# EasyEDA Pro project ProPrj_嵌赛国赛_2025-08-15.epro, schematic Schematic3

## Sheets
1 P1: Board Name: 药箱传感器板; Create Date: 2025-06-10; Page Name: P1; Project Name: 嵌入式大赛; Schematic Name: Schematic3; Update Date: 2025-06-26; Company: 嘉立创EDA; Page Size: A4; Version: V1.0
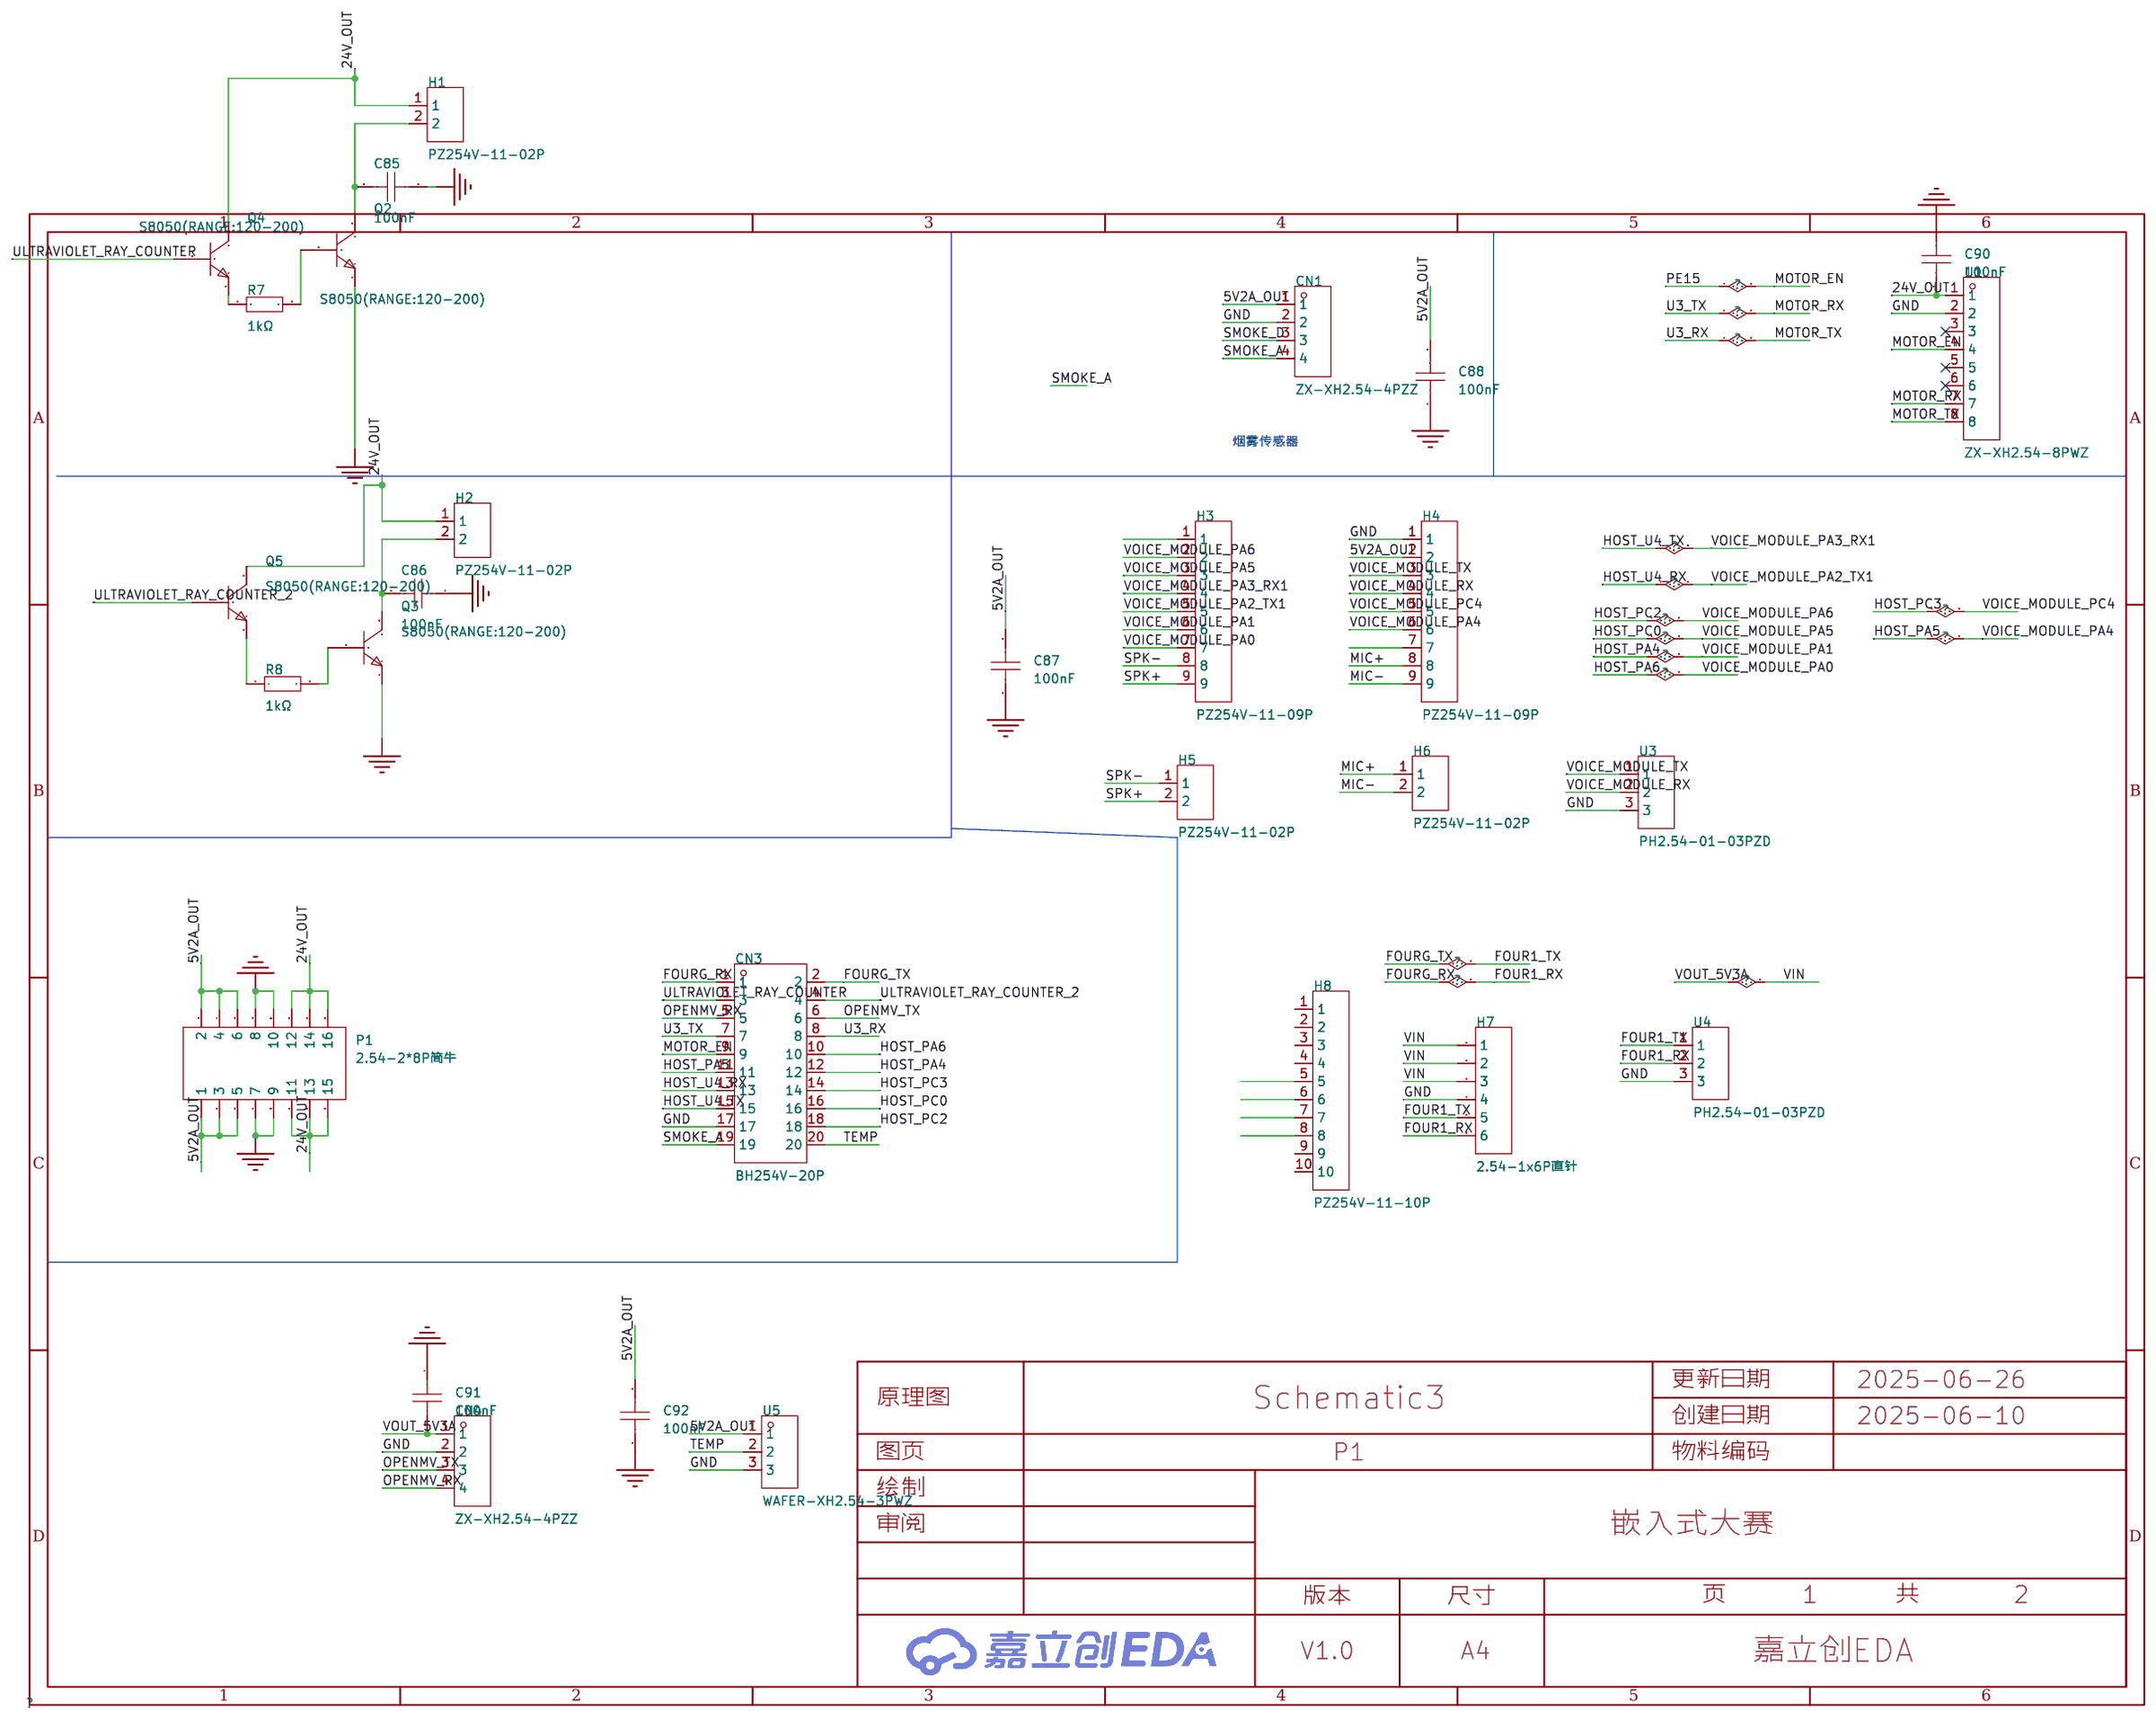
[diagram p2: P1]
2 P2: Create Date: 2025-06-18; Page Name: P2; Update Date: 2025-06-18
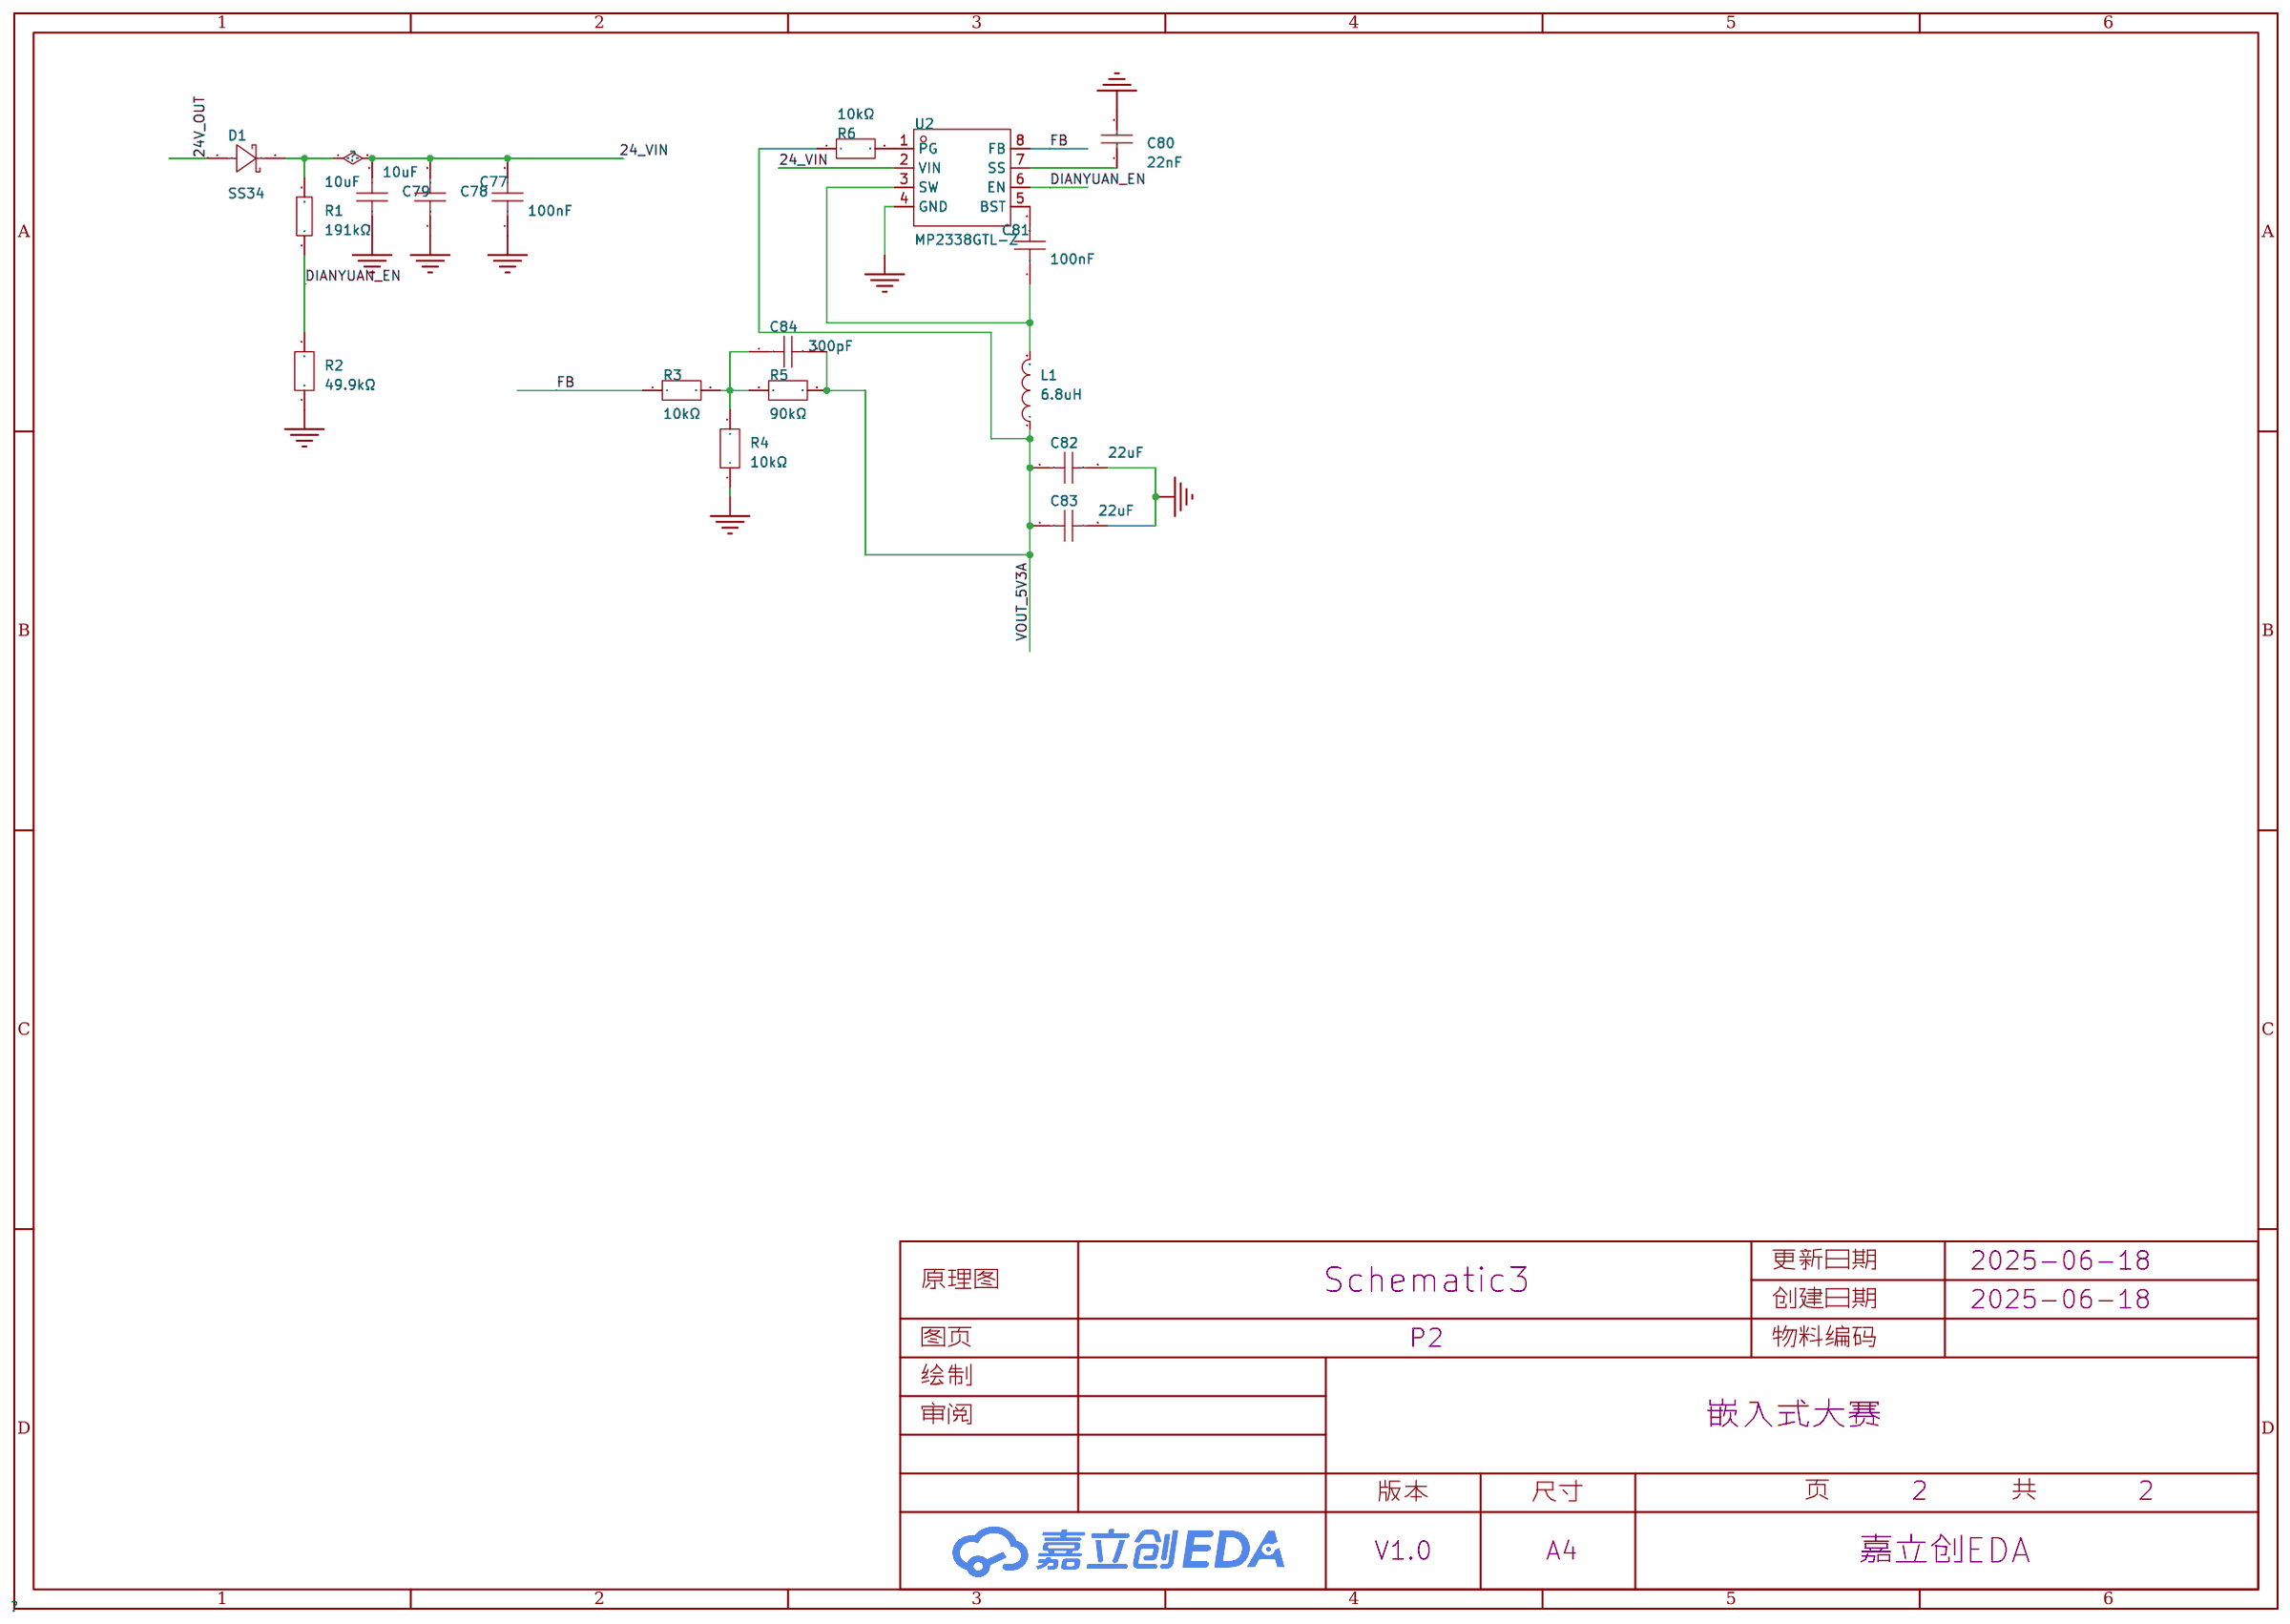
[diagram p3: P2]

## Parts
sheet P1
C85  100nF  [C0603]
C86  100nF  [C0603]
C87  100nF  [C0603]
C88  100nF  [C0603]
C90  100nF  [C0603]
C91  100nF  [C0603]
C92  100nF  [C0603]
CN1  ZX-XH2.54-4PZZ  [CONN-TH_4P-P2.50_4PIN]
CN3  BH254V-20P  [CONN-TH_20P-P2.54_0702462001]
CN4  ZX-XH2.54-4PZZ  [CONN-TH_4P-P2.50_4PIN]
H1  PZ254V-11-02P  [HDR-TH_2P-P2.54-V-M]
H2  PZ254V-11-02P  [HDR-TH_2P-P2.54-V-M]
H3  PZ254V-11-09P  [HDR-TH_9P-P2.54-V-M]
H4  PZ254V-11-09P  [HDR-TH_9P-P2.54-V-M]
H5  PZ254V-11-02P  [HDR-TH_2P-P2.54-V-M]
H6  PZ254V-11-02P  [HDR-TH_2P-P2.54-V-M]
H7  2.54-1x6P直针  [HDR-TH_6P-P2.54-V-M-1]
H8  PZ254V-11-10P  [HDR-TH_10P-P2.54-V-M]
P1  2.54-2*8P简牛  [IDC-TH_16P-P2.54_C3406]
Q2  S8050(RANGE:120-200)  [TO-92-3_L4.9-W3.7-P1.27-L]
Q3  S8050(RANGE:120-200)  [TO-92-3_L4.9-W3.7-P1.27-L]
Q4  S8050(RANGE:120-200)  [TO-92-3_L4.9-W3.7-P1.27-L]
Q5  S8050(RANGE:120-200)  [TO-92-3_L4.9-W3.7-P1.27-L]
R7  1kΩ  [R0603]
R8  1kΩ  [R0603]
U1  ZX-XH2.54-8PWZ  [CONN-TH_8P-P2.50_ZX-XH2.54-8PWZ]
U3  PH2.54-01-03PZD  [HDR-TH_3P-P2.54-V-M]
U4  PH2.54-01-03PZD  [HDR-TH_3P-P2.54-V-M]
U5  WAFER-XH2.54-3PWZ  [CONN-TH_3P-P2.50_WAFER-XH2.54-3PWZ]
sheet P2
C77  100nF  [C0603]
C78  10uF  [C1206]
C79  10uF  [C1206]
C80  22nF  [C0603]
C81  100nF  [C0603]
C82  22uF  [C0603]
C83  22uF  [C0603]
C84  300pF  [C0603]
D1  SS34  [SMA_L4.3-W2.6-LS5.0-FD]
L1  6.8uH  [IND-SMD_L11.0-W10.0]
R1  191kΩ  [R0603]
R2  49.9kΩ  [R0603]
R3  10kΩ  [R0603]
R4  10kΩ  [R0603]
R5  90kΩ  [R0603]
R6  10kΩ  [R0603]
U2  MP2338GTL-Z  [SOT-583-8_L2.1-W1.2-P0.50-LS1.6-BR]

## Library data of the parts
C77 C81 C85-C88 C90-C92 = CC0603KRX7R9BB104: 容值:100nF;精度:±10%;额定电压:50V;材质(温度系数):X7R;; LCSC Part Name: 100nF ±10% 50V; Supplier Part: C14663; Manufacturer: YAGEO(国巨); Supplier Footprint: 0603; JLCPCB Part Class: Basic Part; Datasheet: https://atta.szlcsc.com/upload/public/pdf/source/20180910/C282072_33301C7F631E79921B82A8DAC6BCC5B3.pdf; Supplier: LCSC; Tolerance: ±10%; Voltage Rated: 50V; Temperature Coefficient: X7R
CN1 CN4 = ZX-XH2.54-4PZZ: 插针结构:1x4P;间距:2.5mm;安装方式:直插;参考系列:XH;总PIN数:4P;排数:1;每排PIN数:4;行距:-;额定电流:3A;触头材质:黄铜;触头镀层:锡;工作温度范围:-25℃~+85℃;; LCSC Part Name: 1x4P 间距:2.5mm 直插 系列:XH; Supplier Part: C7429634; Manufacturer: Megastar(兆星); Supplier Footprint: 插件,P=2.5mm; JLCPCB Part Class: 扩展库; Datasheet: https://atta.szlcsc.com/upload/public/pdf/source/20230619/B529A2163E0159A644AB3383D208FB03.pdf; Supplier: LCSC; Pins Structure: 1x4P; Pitch: 2.5mm; Mounting Type: 直插; Reference Series: XH; Number of Pins: 4P; Number of Rows: 1; Number of PINs Per Row: 4; Rated Current: 3A; Contact Material: 黄铜; Contact Plating: 锡; Operating Temperature: -25℃~+85℃; Rated Voltage (Max): 250V; Plastic Material: PA66; Flame Retardant Rating: UL94V-0; Color: 白色; Z-Height of the Board: 7mm; X-Length of Bottom Edge on Board (Spacing Line): 12.5mm; Y-Width of Bottom Edge on Board: 5.9mm
CN3 = BH254V-20P: 连接器类型:简牛座;间距:-;结构:2x10P;额定电流:3A;额定电压:250V;封装形式:直插;行距:2.54mm;排数:2;每排PIN数:10;触头材质:-;触头镀层:-;工作温度范围:-40℃~+105℃;焊接温度(最大值):-;; LCSC Part Name: 2x10P 排数:2 每排P数:10; Supplier Part: C492444; Manufacturer: XFCN(兴飞); Supplier Footprint: 插件,P=2.54mm; JLCPCB Part Class: 扩展库; Datasheet: https://atta.szlcsc.com/upload/public/pdf/source/20200312/C492444_4AABE2FC4F6BE8226B85135616AF0092.pdf; Supplier: LCSC; Connector Type: 简牛座; Structure: 2x10P; Current Rating (Max): 3A; Voltage Rating (Max): 250V; Holder Type: 直插; Row Spacing: 2.54mm; Number of Rows: 2; Pin Number in each Row: 10; Operating Temperature Range: -40℃~+105℃
H1 H2 H5 H6 = PZ254V-11-02P: 插针结构:1x2P;间距:2.54mm;行距:-;圆针/方针:方针;安装方式:直插;排数:单排;总PIN位数:2P;额定电流:-;额定电压:-;配合针长度:6mm;塑高:2.5mm;端接针长度:3mm;触头材质:黄铜;触头镀层:-;工作温度:-40℃~+105℃;颜色:黑色;; LCSC Part Name: 1x2P 间距:2.54mm 方针 直插; Supplier Part: C492401; Manufacturer: XFCN(兴飞); Supplier Footprint: 插件,P=2.54mm; JLCPCB Part Class: Extended Part; Datasheet: https://atta.szlcsc.com/upload/public/pdf/source/20200309/C492401_A812433581A9B211A7FFA413ADDFF0E5.pdf; Supplier: LCSC; Pin Structure: 1x2P; Pitch: 2.54mm; Circluar Pins/Square Pins: 方针; Mounting Type: 直插; Number of Rows: 单排; Number of Pins: 2P; Length of Mating Pin: 6mm; Insulation Height: 2.5mm; Length of End Connection Pin: 3mm; Contact Material: 黄铜; Operating Temperature: -40℃~+105℃; Color: 黑色
H3 H4 = PZ254V-11-09P: 插针结构:1x9P;间距:2.54mm;行距:-;圆针/方针:方针;安装方式:直插;排数:单排;总PIN位数:9P;额定电流:-;额定电压:-;配合针长度:6mm;塑高:2.5mm;端接针长度:3mm;触头材质:黄铜;触头镀层:-;工作温度:-40℃~+105℃;颜色:黑色;; LCSC Part Name: 1x9P 间距:2.54mm 方针 直插; Supplier Part: C492408; Manufacturer: XFCN(兴飞); Supplier Footprint: 插件,P=2.54mm; JLCPCB Part Class: 扩展库; Datasheet: https://atta.szlcsc.com/upload/public/pdf/source/20200309/C492408_0CE6AEE885DD471CEFA4BE32B6482CF7.pdf; Supplier: LCSC; Pin Structure: 1x9P; Pitch: 2.54mm; Circluar Pins/Square Pins: 方针; Mounting Type: 直插; Number of Rows: 单排; Number of Pins: 9P; Length of Mating Pin: 6mm; Insulation Height: 2.5mm; Length of End Connection Pin: 3mm; Contact Material: 黄铜; Operating Temperature: -40℃~+105℃; Color: 黑色
H7 = 2.54-1x6P直针: 插针结构:1x6P;间距:2.54mm;行距:-;圆针/方针:方针;安装方式:直插;排数:单排;总PIN位数:6P;额定电流:3A;额定电压:-;配合针长度:-;塑高:-;触头材质:黄铜;触头镀层:-;工作温度:-40℃~+105℃;颜色:黑色;; LCSC Part Name: 1x6P 间距:2.54mm 方针 直插; Supplier Part: C37208; Manufacturer: BOOMELE(博穆精密); Supplier Footprint: 插件,P=2.54mm; JLCPCB Part Class: 扩展库; Datasheet: https://atta.szlcsc.com/upload/public/pdf/source/20250115/42A019761A40C8B839643401D8CA5A96.pdf; Supplier: LCSC; Pin Structure: 1x6P; Pitch: 2.54mm; Circluar Pins/Square Pins: 方针; Mounting Type: 直插; Number of Rows: 单排; Number of Pins: 6P; Current Rating: 3A; Contact Material: 黄铜; Operating Temperature: -40℃~+105℃; Color: 黑色
H8 = PZ254V-11-10P: 插针结构:1x10P;间距:2.54mm;行距:-;圆针/方针:方针;安装方式:直插;排数:单排;总PIN位数:10P;额定电流:-;额定电压:-;配合针长度:6mm;塑高:2.5mm;端接针长度:3mm;触头材质:黄铜;触头镀层:-;工作温度:-40℃~+105℃;颜色:黑色;; LCSC Part Name: 1x10P 间距:2.54mm 方针 直插; Supplier Part: C492409; Manufacturer: XFCN(兴飞); Supplier Footprint: 插件,P=2.54mm; JLCPCB Part Class: 扩展库; Datasheet: https://atta.szlcsc.com/upload/public/pdf/source/20200309/C492409_129C9431BDD62EBBBD0A643B6AAB9FBD.pdf; Supplier: LCSC; Pin Structure: 1x10P; Pitch: 2.54mm; Circluar Pins/Square Pins: 方针; Mounting Type: 直插; Number of Rows: 单排; Number of Pins: 10P; Length of Mating Pin: 6mm; Insulation Height: 2.5mm; Length of End Connection Pin: 3mm; Contact Material: 黄铜; Operating Temperature: -40℃~+105℃; Color: 黑色
P1 = 2.54-2*8P简牛: 连接器类型:简牛座;间距:2.54mm;结构:2x8P;封装形式:直插;行距:2.54mm;排数:2;每排PIN数:8;触头材质:-;触头镀层:-;; LCSC Part Name: 2.54mm 2x8P 排数:2 每排P数:8; Supplier Part: C3406; Manufacturer: BOOMELE(博穆精密); Supplier Footprint: 插件,P=2.54mm; JLCPCB Part Class: 扩展库; Datasheet: https://atta.szlcsc.com/upload/public/pdf/source/20131122/1457706661483.pdf; Supplier: LCSC; Connector Type: 简牛座; Pitch: 2.54mm; Structure: 2x8P; Holder Type: 直插; Row Spacing: 2.54mm; Number of Rows: 2; Pin Number in each Row: 8
Q2-Q5 = S8050(RANGE:120-200)_C141642: 晶体管类型:NPN;集电极电流(Ic):500mA;集射极击穿电压(Vceo):25V;耗散功率(Pd):625mW;直流电流增益(hFE):120@50mA,1V;; LCSC Part Name: C档(120~200); Supplier Part: C141642; Manufacturer: CJ(江苏长电/长晶); Supplier Footprint: TO-92-3; JLCPCB Part Class: 扩展库; Datasheet: https://atta.szlcsc.com/upload/public/pdf/source/20171113/C141642_15105613285671115816.pdf; Supplier: LCSC; type: NPN; Current - Collector(Ic): 500mA; Collector - Emitter Voltage VCEO: 25V; Pd - Power Dissipation: 625mW; DC Current Gain: 120@50mA,1V; Transition frequency(fT): 150MHz; Current - Collector Cutoff: 100nA; Vce Saturation(VCE(sat)): 600mV
R7 R8 = 0603WAF1002T5E: 电阻类型:厚膜电阻;阻值:10kΩ;精度:±1%;功率:100mW;最大工作电压:75V;温度系数:±100ppm/℃;; LCSC Part Name: 厚膜电阻 10kΩ ±1% 100mW; Supplier Part: C25804; Manufacturer: UNI-ROYAL(厚声); Supplier Footprint: 0603; JLCPCB Part Class: Basic Part; Datasheet: https://atta.szlcsc.com/upload/public/pdf/source/20200306/C422600_1E6D84923E4A46A82E41ADD87F860B5C.pdf; Supplier: LCSC; Type: 厚膜电阻; Tolerance: ±1%; Power(Watts): 100mW; Overload Voltage (Max): 75V; Temperature Coefficient: ±100ppm/℃; Operating Temperature Range: -55℃~+155℃
U1 = ZX-XH2.54-8PWZ: 插针结构:1x8P;间距:2.5mm;安装方式:弯插;参考系列:XH;总PIN数:8P;排数:1;每排PIN数:8;行距:-;额定电流:3A;触头材质:黄铜;触头镀层:锡;工作温度范围:-25℃~+85℃;; LCSC Part Name: 1x8P 间距:2.5mm 弯插 系列:XH; Supplier Part: C7429647; Manufacturer: Megastar(兆星); Supplier Footprint: 弯插,P=2.5mm; JLCPCB Part Class: 扩展库; Datasheet: https://atta.szlcsc.com/upload/public/pdf/source/20230619/825E28BFFB9F3B9EEDAD896C78D625B2.pdf; Supplier: LCSC; Pins Structure: 1x8P; Pitch: 2.5mm; Mounting Type: 弯插; Reference Series: XH; Number of Pins: 8P; Number of Rows: 1; Number of PINs Per Row: 8; Rated Current: 3A; Contact Material: 黄铜; Contact Plating: 锡; Operating Temperature: -25℃~+85℃; Rated Voltage (Max): 250V; Plastic Material: PA66; Flame Retardant Rating: UL94V-0; Color: 白色; Z-Height of the Board: 5.9mm; X-Length of Bottom Edge on Board (Spacing Line): 22.5mm; Y-Width of Bottom Edge on Board: 7.32mm
U3 U4 = PH2.54-01-03PZD: 插针结构:1x3P;间距:2.54mm;圆针/方针:方针;安装方式:直插;排数:单排;总PIN位数:3P;配合针长度:6mm;塑高:2.5mm;端接针长度:3mm;触头材质:黄铜;工作温度:-40℃~+105℃;颜色:黑色;; LCSC Part Name: 1x3P 间距:2.54mm 方针 直插; Supplier Part: C7501581; Manufacturer: XUNPU(讯普); Supplier Footprint: 插件,P=2.54mm; JLCPCB Part Class: 扩展库; Datasheet: https://atta.szlcsc.com/upload/public/pdf/source/20230815/30A24B1E4B9BDE2239C7F8E56770F33B.pdf; Supplier: LCSC; Pin Structure: 1x3P; Pitch: 2.54mm; Circluar Pins/Square Pins: 方针; Mounting Type: 直插; Number of Rows: 单排; Number of Pins: 3P; Length of Mating Pin: 6mm; Insulation Height: 2.5mm; Length of End Connection Pin: 3mm; Contact Material: 黄铜; Operating Temperature: -40℃~+105℃; Color: 黑色
U5 = WAFER-XH2.54-3PWZ: 插针结构:1x3P;间距:2.5mm;安装方式:弯插;参考系列:XH;总PIN数:3P;排数:1;每排PIN数:3;行距:-;额定电流:2A;触头材质:黄铜;触头镀层:锡;工作温度:-25℃~+85℃;; LCSC Part Name: 1x3P 间距:2.5mm 弯插 系列:XH; Supplier Part: C5374806; Manufacturer: XUNPU(讯普); Supplier Footprint: 弯插,P=2.5mm; JLCPCB Part Class: 扩展库; Datasheet: https://atta.szlcsc.com/upload/public/pdf/source/20230221/397FB6E0B838EFC6EA17AAEABEF58A8D.pdf; Supplier: LCSC; Pins Structure: 1x3P; Pitch: 2.5mm; Mounting Type: 弯插; Reference Series: XH; Number of Pins: 3P; Number of Rows: 1; Number of PINs Per Row: 3; Current Rating: 2A; Contact Material: 黄铜; Contact Plating: 锡; Operating Temperature: -25℃~+85℃; Voltage Rating: 250V; Plastic Material: PA66; Flame Retardant Rating: UL94V-0; Color: 白色; Z-Height of the Board: 5.9mm; X-Length of Bottom Edge on Board (Spacing Line): 10mm; Y-Width of Bottom Edge on Board: 7.32mm
C78 C79 = HGC1206R5106K500NSPJ: 容值:10uF;精度:±10%;额定电压:50V;材质(温度系数):X5R;; LCSC Part Name: 10uF ±10% 50V; Supplier Part: C7432781; Manufacturer: Chinocera(华瓷); Supplier Footprint: 1206; JLCPCB Part Class: 扩展库; Datasheet: https://atta.szlcsc.com/upload/public/pdf/source/20240320/FAC3FEC40A78BC5CCCE96C232A94D860.pdf; Supplier: LCSC; Tolerance: ±10%; Voltage Rated: 50V; Temperature Coefficient: X5R
C80 = CL10B223KB8NNNC: 容值:22nF;精度:±10%;额定电压:50V;材质(温度系数):X7R;; LCSC Part Name: 22nF ±10% 50V; Supplier Part: C21122; Manufacturer: SAMSUNG(三星); Supplier Footprint: 0603; JLCPCB Part Class: 基础库; Datasheet: https://atta.szlcsc.com/upload/public/pdf/source/20160218/1457707763339.pdf; Supplier: LCSC; Tolerance: ±10%; Voltage Rated: 50V; Temperature Coefficient: X7R
C82 C83 = CGA0603X5R226M160JT: 容值:22uF;精度:±20%;额定电压:16V;温度系数:X5R;; LCSC Part Name: 22uF ±20% 16V; Supplier Part: C6119868; Manufacturer: HRE(芯声); Supplier Footprint: 0603; JLCPCB Part Class: 扩展库; Datasheet: https://atta.szlcsc.com/upload/public/pdf/source/20250121/36E435B8815E1026A710792D223DB526.pdf; Supplier: LCSC; Tolerance: ±20%; Voltage Rating: 16V; Temperature Coefficient: X5R
C84 = CC0603JRNPO9BN301: 容值:300pF;精度:±5%;额定电压:50V;材质(温度系数):NP0;; LCSC Part Name: 300pF ±5% 50V; Supplier Part: C519401; Manufacturer: YAGEO(国巨); Supplier Footprint: 0603; JLCPCB Part Class: 扩展库; Datasheet: https://atta.szlcsc.com/upload/public/pdf/source/20200423/C519401_2047077801E3794C35D33CD0926CFD8F.pdf; Supplier: LCSC; Tolerance: ±5%; Voltage Rated: 50V; Temperature Coefficient: NP0
D1 = SS34_C7420365: 二极管配置:独立式;正向压降(Vf):550mV@3.0A;直流反向耐压(Vr):40V;平均整流电流(Io):3A;; LCSC Part Name: 电压:40V 电流:3A; Supplier Part: C7420365; Manufacturer: 宏迦橙; Supplier Footprint: SMA(DO-214AC); JLCPCB Part Class: 扩展库; Datasheet: https://atta.szlcsc.com/upload/public/pdf/source/20230828/75438452AEE6C276EDA92B2AF599BE05.pdf; Supplier: LCSC; Diode Configuration: 独立式; Forward Voltage (Vf@If): 550mV@3.0A; Reverse Voltage (Vr): 40V; Average Rectified Current (Io): 3A; Reverse Leakage Current (Ir): 200uA@40V; Peak forward surge current: 80A
L1 = RS1040-6R8MS: 电感值:6.8uH;精度:±20%;额定电流:8.5A;饱和电流(Isat):12A;类型:一体成型电感;; LCSC Part Name: 一体成型贴片电感; Supplier Part: C32712978; Manufacturer: Ruishen(瑞申电子); Supplier Footprint: SMD,11x10mm; JLCPCB Part Class: Extended Part; Datasheet: https://atta.szlcsc.com/upload/public/pdf/source/20240725/1479F0C5398E8B8CE228DA1AA8F66FED.pdf; Supplier: LCSC; Tolerance: ±20%; Current Rating: 8.5A; Current - Saturation(Isat): 12A; DC Resistance(DCR): 22mΩ; Type: 一体成型电感
R1 = 0603WAF1913T5E: 电阻类型:厚膜电阻;阻值:191kΩ;精度:±1%;功率:100mW;最大工作电压:75V;温度系数:±100ppm/℃;; LCSC Part Name: 191kΩ ±1% 100mW 厚膜电阻; Supplier Part: C22932; Manufacturer: UNI-ROYAL(厚声); Supplier Footprint: 0603; JLCPCB Part Class: 扩展库; Datasheet: https://atta.szlcsc.com/upload/public/pdf/source/20200306/C422600_1E6D84923E4A46A82E41ADD87F860B5C.pdf; Supplier: LCSC; Type: 厚膜电阻; Tolerance: ±1%; Power(Watts): 100mW; Overload Voltage (Max): 75V; Temperature Coefficient: ±100ppm/℃; Operating Temperature Range: -55℃~+155℃
R2 = FRC0603F4992TS: 电阻类型:厚膜电阻;阻值:49.9kΩ;精度:±1%;功率:100mW;最大工作电压:75V;温度系数:±100ppm/℃;; LCSC Part Name: 49.9kΩ ±1% 100mW 厚膜电阻; Supplier Part: C2930109; Manufacturer: FOJAN(富捷); Supplier Footprint: 0603; JLCPCB Part Class: 扩展库; Datasheet: https://atta.szlcsc.com/upload/public/pdf/source/20211221/925EC7D7225764EE0046F22065062C87.pdf; Supplier: LCSC; Type: 厚膜电阻; Tolerance: ±1%; Power(Watts): 100mW; Overload Voltage (Max): 75V; Temperature Coefficient: ±100ppm/℃; Operating Temperature Range: -55℃~+155℃
R3 R4 R6 = FRC0603J103TS: 电阻类型:厚膜电阻;阻值:10kΩ;精度:±5%;功率:100mW;最大工作电压:75V;温度系数:±100ppm/℃;; LCSC Part Name: 10kΩ ±5% 100mW 厚膜电阻; Supplier Part: C2930027; Manufacturer: FOJAN(富捷); Supplier Footprint: 0603; JLCPCB Part Class: 扩展库; Datasheet: https://atta.szlcsc.com/upload/public/pdf/source/20211221/925EC7D7225764EE0046F22065062C87.pdf; Supplier: LCSC; Type: 厚膜电阻; Tolerance: ±5%; Power(Watts): 100mW; Overload Voltage (Max): 75V; Temperature Coefficient: ±100ppm/℃; Operating Temperature Range: -55℃~+155℃
R5 = 0603WAF9002T5E: 电阻类型:厚膜电阻;阻值:90kΩ;精度:±1%;功率:100mW;最大工作电压:75V;温度系数:±100ppm/℃;; LCSC Part Name: 90kΩ ±1% 100mW 厚膜电阻; Supplier Part: C2767219; Manufacturer: UNI-ROYAL(厚声); Supplier Footprint: 0603; JLCPCB Part Class: 扩展库; Datasheet: https://atta.szlcsc.com/upload/public/pdf/source/20200306/C422600_1E6D84923E4A46A82E41ADD87F860B5C.pdf; Supplier: LCSC; Type: 厚膜电阻; Tolerance: ±1%; Power(Watts): 100mW; Overload Voltage (Max): 75V; Temperature Coefficient: ±100ppm/℃; Operating Temperature Range: -55℃~+155℃
U2 = MP2338GTL-Z_C7210174: 功能类型:降压型;输出类型:可调;工作电压:4.5V~28V;输出电压:500mV~16V;输出电流:3A;; LCSC Part Name: 高效率28V 3A 450kHz同步降压转换器; Supplier Part: C7210174; Manufacturer: MPS(芯源); Supplier Footprint: SOT-583; JLCPCB Part Class: 扩展库; Datasheet: https://atta.szlcsc.com/upload/public/pdf/source/20240423/047B0C26FE0EA84694A976250651CD0F.pdf; Supplier: LCSC; Function: 降压型; Output Type: 可调; Input Voltage: 4.5V~28V; Output Voltage: 500mV~16V; Output Current: 3A; Switching Frequency: 450kHz; Operating Temperature: -40℃~+125℃; Synchronous Rectification: 是; Number of Outputs: 1; Topology: 降压式; Quiescent Current (Iq): 160uA; Switch tube (built-in/external): 内置

## Nets
5V2A_OUT: C87.2 C88.2 C92.2 CN1.1 H4.2 P1.1 P1.2 P1.3 P1.4 P1.5 P1.6 U5.1
24V_OUT: C90.2 D1.1(A) H1.1 H2.1 P1.11 P1.12 P1.13 P1.14 P1.15 P1.16 Q4.3(C) Q5.3(C) U1.1
GND: C77.1 C78.1 C79.1 C80.2 C82.2 C83.2 C85.1 C86.1 C87.1 C88.1 C90.1 C91.1 C92.1 CN1.2 CN3.17 CN4.2 H4.1 H7.4 P1.7 P1.8 P1.9 P1.10 Q2.1(E) Q3.1(E) R2.1 R4.1 U1.2 U2.4(GND) U3.3 U4.3 U5.3
VIN: C82.1 C83.1 C84.2 C91.2 CN4.1 H7.1 H7.2 H7.3 L1.1 R5.2 R6.1
24_VIN: C77.2 C78.2 C79.2 D1.2(K) R1.2 U2.2(VIN)
DIANYUAN_EN: R1.1 R2.2 U2.6(EN)
FB: R3.1 U2.8(FB)
FOUR1_RX: CN3.1 H7.6 U4.2
FOUR1_TX: CN3.2 H7.5 U4.1
HOST_PA4: CN3.12 H3.6
HOST_PA5: CN3.11 H4.6
HOST_PA6: CN3.10 H3.7
HOST_PC0: CN3.16 H3.3
HOST_PC2: CN3.18 H3.2
HOST_PC3: CN3.14 H4.5
HOST_U4_RX: CN3.13 H3.5
HOST_U4_TX: CN3.15 H3.4
MIC+: H4.8 H6.1
MIC-: H4.9 H6.2
MOTOR_EN: CN3.9 U1.4
MOTOR_RX: CN3.7 U1.7
MOTOR_TX: CN3.8 U1.8
OPENMV_RX: CN3.5 CN4.4
OPENMV_TX: CN3.6 CN4.3
SMOKE_A: CN1.4 CN3.19
SMOKE_D: CN1.3
SPK+: H3.9 H5.2
SPK-: H3.8 H5.1
TEMP: CN3.20 U5.2
ULTRAVIOLET_RAY_COUNTER: CN3.3 Q4.2(B)
ULTRAVIOLET_RAY_COUNTER_2: CN3.4 Q5.2(B)
VOICE_MODULE_RX: H4.4 U3.2
VOICE_MODULE_TX: H4.3 U3.1
$1N464: C85.2 H1.2 Q2.3(C)
$1N705: C86.2 H2.2 Q3.3(C)
$1N7267: Q4.1(E) R7.1
$1N7311: Q2.2(B) R7.2
$1N7416: Q5.1(E) R8.1
$1N7421: Q3.2(B) R8.2
$2N835: C80.1 U2.7(SS)
$2N852: C81.2 U2.5(BST)
$2N854: C81.1 L1.2 U2.3(SW)
$2N884: C84.1 R3.2 R4.2 R5.1
$2N892: R6.2 U2.1(PG)

Not connected (* = marked no-connect by the designer): H3 1; H4 7; H8 1 2 3 4 5 6 7 8 9 10; U1 3* 5* 6*

## Notes on the sheets
sheet 1
- 烟雾传感器
